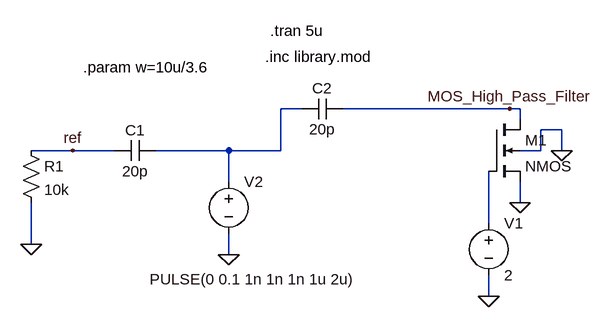
[diagram p0: schematic quiz2.asc]
quiz2.asc, the LTspice schematic file:
Version 4
SHEET 1 880 680
WIRE 368 32 336 32
WIRE 688 32 432 32
WIRE 704 32 688 32
WIRE 704 48 704 32
WIRE 768 64 736 64
WIRE 16 96 -48 96
WIRE 80 96 16 96
WIRE 256 96 144 96
WIRE 336 96 336 32
WIRE 336 96 256 96
WIRE 736 96 736 64
WIRE 736 96 704 96
WIRE 768 96 768 64
WIRE 256 144 256 96
WIRE 704 176 704 144
WIRE 656 208 656 128
WIRE -48 240 -48 176
WIRE 256 256 256 224
WIRE 656 320 656 288
FLAG -48 240 0
FLAG 256 256 0
FLAG 656 320 0
FLAG 704 176 0
FLAG 768 96 0
FLAG 688 32 MOS_High_Pass_Filter
FLAG 16 96 ref
SYMBOL res -64 80 R0
SYMATTR InstName R1
SYMATTR Value 10k
SYMBOL voltage 656 192 R0
WINDOW 123 0 0 Left 0
WINDOW 39 0 0 Left 0
SYMATTR InstName V1
SYMATTR Value 2
SYMBOL voltage 256 128 R0
WINDOW 3 -122 166 Left 2
WINDOW 123 0 0 Left 0
WINDOW 39 0 0 Left 0
SYMATTR Value PULSE(0 0.1 1n 1n 1n 1u 2u)
SYMATTR InstName V2
SYMBOL nmos4 656 48 R0
SYMATTR InstName M1
SYMATTR Value2 l=10u w=w
SYMBOL cap 144 80 R90
WINDOW 0 0 32 VBottom 2
WINDOW 3 32 32 VTop 2
SYMATTR InstName C1
SYMATTR Value 20p
SYMBOL cap 432 16 R90
WINDOW 0 0 32 VBottom 2
WINDOW 3 32 32 VTop 2
SYMATTR InstName C2
SYMATTR Value 20p
TEXT 312 -48 Left 2 !.inc library.mod
TEXT 320 -88 Left 2 !.tran 5u
TEXT 32 -32 Left 2 !.param w=10u/3.6

The netlist it stands for:
* quiz2.asc
R1 ref 0 10k
V1 N002 0 2
V2 N001 0 PULSE(0 0.1 1n 1n 1n 1u 2u)
M1 MOS_High_Pass_Filter N002 0 0 NMOS l=10u w=w
C1 N001 ref 20p
C2 MOS_High_Pass_Filter N001 20p
.model NMOS NMOS
.model PMOS PMOS
.lib standard.mos
.inc library.mod
.tran 5u
.param w=10u/3.6
.backanno
.end

* Results of the author's LTspice run, read from the files saved beside the schematic
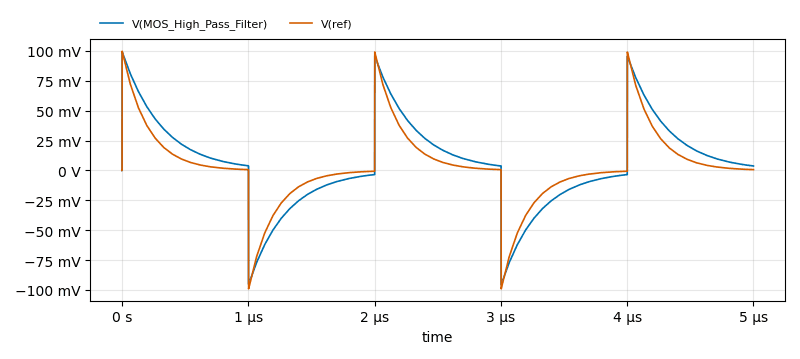
[diagram p1: Transient Analysis of quiz2.asc, plotted from the saved traces]
* Transient Analysis, 1 run:
*   V(MOS_High_Pass_Filter): min -95.51 mV, max 99.14 mV, average 6.396 mV, rms 38.05 mV, last 3.738 mV
*   V(ref): min -99.08 mV, max 99.75 mV, average 4.012 mV, rms 31.97 mV, last 674.1 µV